# Altium schematic sheet Top Level.SchDoc
size A4
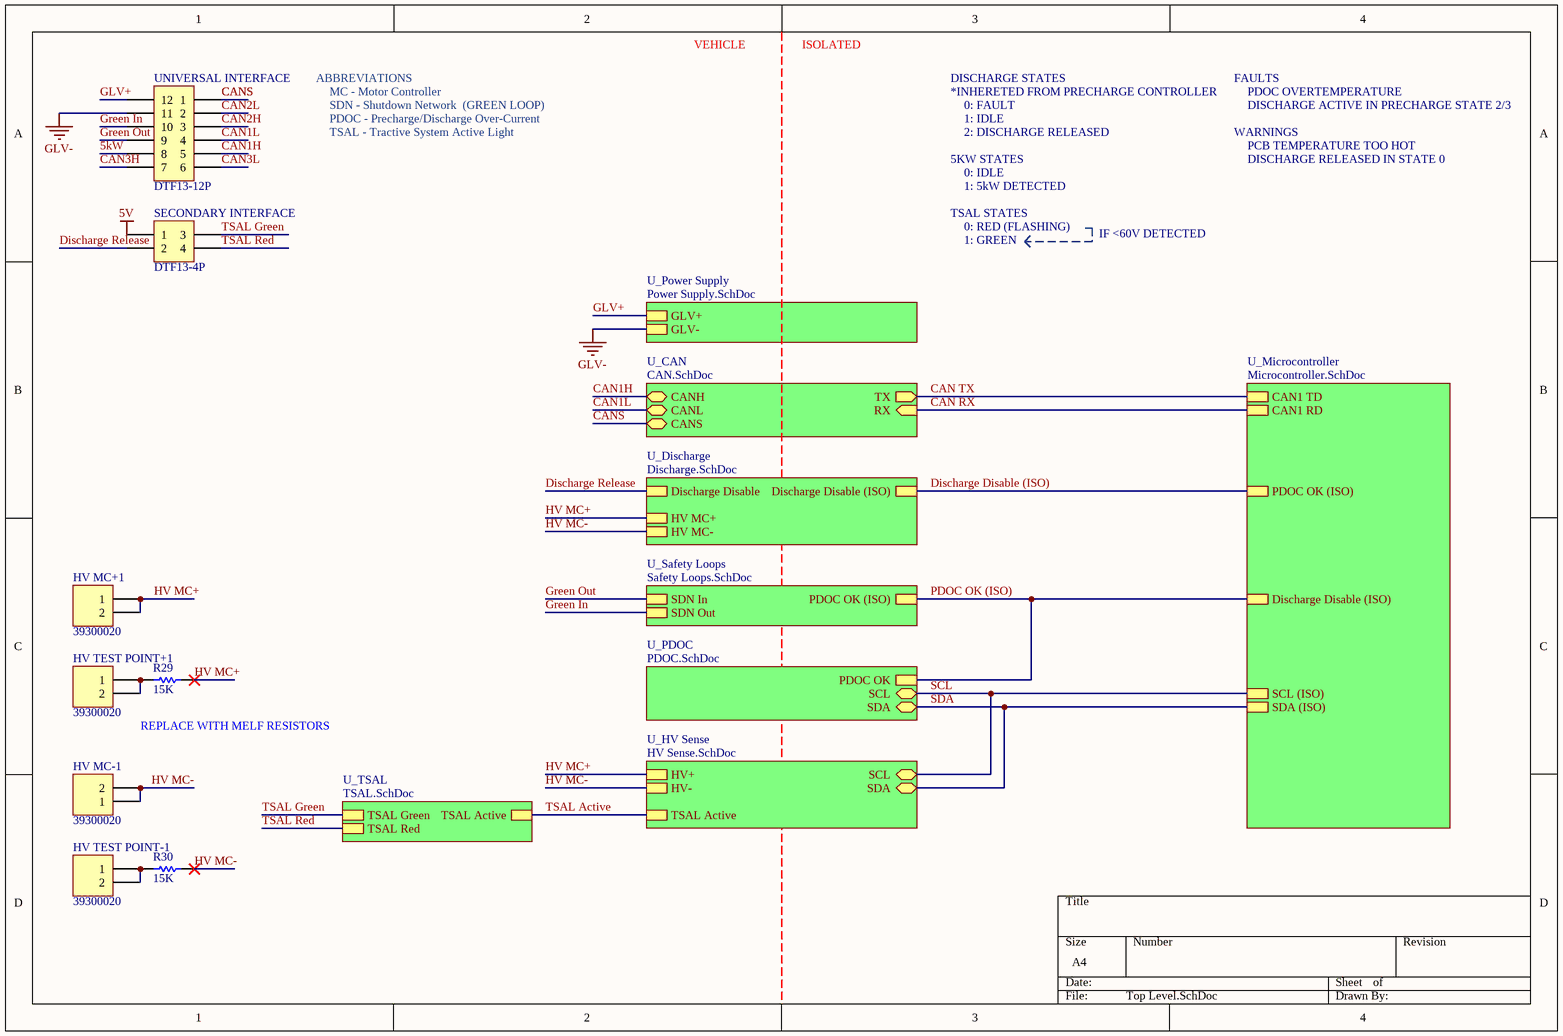
[diagram p0: Top Level.SchDoc]

## Parts
HV_MC+1  39300020  [39300020]
HV_MC-1  39300020  [39300020]
HV_TEST_POINT+1  39300020  [39300020]
HV_TEST_POINT-1  39300020  [39300020]
R29  15K  [VB 0204]
R30  15K  [VB 0204]
SECONDARY_INTERFACE  DTF13-4P  [DTF13-4P]
UNIVERSAL_INTERFACE  DTF13-12P  [DTF13-12P]

## Sub-sheets
U_CAN = CAN.SchDoc: CANS (bidir), RX (in), CANL (bidir), CANH (bidir), TX (out)
U_Discharge = Discharge.SchDoc: HV MC+, HV MC-, Discharge Disable, Discharge Disable (ISO)
U_HV Sense = HV Sense.SchDoc: HV+, HV-, SCL (bidir), SDA (bidir), TSAL Active
U_Microcontroller = Microcontroller.SchDoc: CAN1 RD, CAN1 TD, PDOC OK (ISO), Discharge Disable (ISO), SDA (ISO), SCL (ISO)
U_PDOC = PDOC.SchDoc: SCL (bidir), SDA (bidir), PDOC OK
U_Power Supply = Power Supply.SchDoc: GLV+, GLV-
U_Safety Loops = Safety Loops.SchDoc: SDN In, SDN Out, PDOC OK (ISO)
U_TSAL = TSAL.SchDoc: TSAL Active, TSAL Green, TSAL Red

## Nets
5V: SECONDARY_INTERFACE.1
GLV-: UNIVERSAL_INTERFACE.11 ; sheet U_Power Supply/GLV-
5kW: UNIVERSAL_INTERFACE.8
CAN1H: UNIVERSAL_INTERFACE.5 ; sheet U_CAN/CANH
CAN1L: UNIVERSAL_INTERFACE.4 ; sheet U_CAN/CANL
CAN2H: UNIVERSAL_INTERFACE.3
CAN2L: UNIVERSAL_INTERFACE.2
CAN3H: UNIVERSAL_INTERFACE.7
CAN3L: UNIVERSAL_INTERFACE.6
CAN RX: sheet U_CAN/RX, sheet U_Microcontroller/CAN1 RD
CAN TX: sheet U_CAN/TX, sheet U_Microcontroller/CAN1 TD
CANS: UNIVERSAL_INTERFACE.1 ; sheet U_CAN/CANS
Discharge Disable (ISO): sheet U_Microcontroller/PDOC OK (ISO), sheet U_Discharge/Discharge Disable (ISO)
Discharge Release: SECONDARY_INTERFACE.2 ; sheet U_Discharge/Discharge Disable
GLV+: UNIVERSAL_INTERFACE.12 ; sheet U_Power Supply/GLV+
Green In: UNIVERSAL_INTERFACE.10 ; sheet U_Safety Loops/SDN Out
Green Out: UNIVERSAL_INTERFACE.9 ; sheet U_Safety Loops/SDN In
HV MC+: HV_MC+1.1 HV_MC+1.2 R29.2 ; sheet U_Discharge/HV MC+, sheet U_HV Sense/HV+
HV MC-: HV_MC-1.1 HV_MC-1.2 R30.2 ; sheet U_Discharge/HV MC-, sheet U_HV Sense/HV-
PDOC OK (ISO): sheet U_Microcontroller/Discharge Disable (ISO), sheet U_Safety Loops/PDOC OK (ISO), sheet U_PDOC/PDOC OK
SCL: sheet U_Microcontroller/SCL (ISO), sheet U_PDOC/SCL, sheet U_HV Sense/SCL
SDA: sheet U_Microcontroller/SDA (ISO), sheet U_PDOC/SDA, sheet U_HV Sense/SDA
TSAL Active: sheet U_TSAL/TSAL Active, sheet U_HV Sense/TSAL Active
TSAL Green: SECONDARY_INTERFACE.3 ; sheet U_TSAL/TSAL Green
TSAL Red: SECONDARY_INTERFACE.4 ; sheet U_TSAL/TSAL Red
NetHV_TEST_POINT+1_1: HV_TEST_POINT+1.1 HV_TEST_POINT+1.2 R29.1
NetHV_TEST_POINT-1_1: HV_TEST_POINT-1.1 HV_TEST_POINT-1.2 R30.1

## Notes on the sheet
- ABBREVIATIONS
- SDN - Shutdown Network  (GREEN LOOP)
- MC - Motor Controller
- VEHICLE
- ISOLATED
- DISCHARGE STATES
- *INHERETED FROM PRECHARGE CONTROLLER
- 0: FAULT
- FAULTS
- PDOC OVERTEMPERATURE
- DISCHARGE ACTIVE IN PRECHARGE STATE 2/3
- PDOC - Precharge/Discharge Over-Current
- TSAL - Tractive System Active Light
- 5KW STATES
- 1: IDLE
- 2: DISCHARGE RELEASED
- 0: IDLE
- WARNINGS
- PCB TEMPERATURE TOO HOT
- DISCHARGE RELEASED IN STATE 0
- TSAL STATES
- 1: 5kW DETECTED
- 0: RED (FLASHING)
- 1: GREEN
- IF <60V DETECTED
- REPLACE WITH MELF RESISTORS

## Library data of the parts
HV_MC+1 HV_MC-1 HV_TEST_POINT+1 HV_TEST_POINT-1 = 39300020: Positions: 2; Pitch: 4.2mm; Row Spacing: 5.5mm; Angle: 90; Flange: No; Contact: Tin; Part Number: 39300020; Digikey Part Number: WM21351-ND
R29 R30 = MMA02040C1502FB300: Manufacturer: Vishay Beyschlag; Tolerance: 0.01; Rated Voltage: 0.4W; Part Number: MMA02040C1502FB300; Value: 15K; Digikey Part Number: MMA-15KACT-ND
SECONDARY_INTERFACE = DTF13-4P[[/\]]DTF13-4P: Positions: 4; Pitch: 9.12mm; Row Spacing: 4.45mm; Angle: 90; Flange: Yes; Contact: Copper Alloy; Part Number: DTF13-4P; Digikey Part Number: 1734-1646-ND; Digikey Link: https://www.digikey.com.au/products/en?keywords=dtf13-4p
UNIVERSAL_INTERFACE = DTF13-12P[[/\]]DTF13-12P: Positions: 12; Pitch: 4.45mm; Angle: 90; Flange: No; Contact: Copper Alloy; Part Number: DTF13-12P; Row Spacing: 4.45mm; Digikey Part Number: 1734-1861-ND; Digikey Link: https://www.digikey.com/products/en?keywords=dtf13-12pa